# EAGLE design A3977_single_axis (EAGLE 7.6.0)
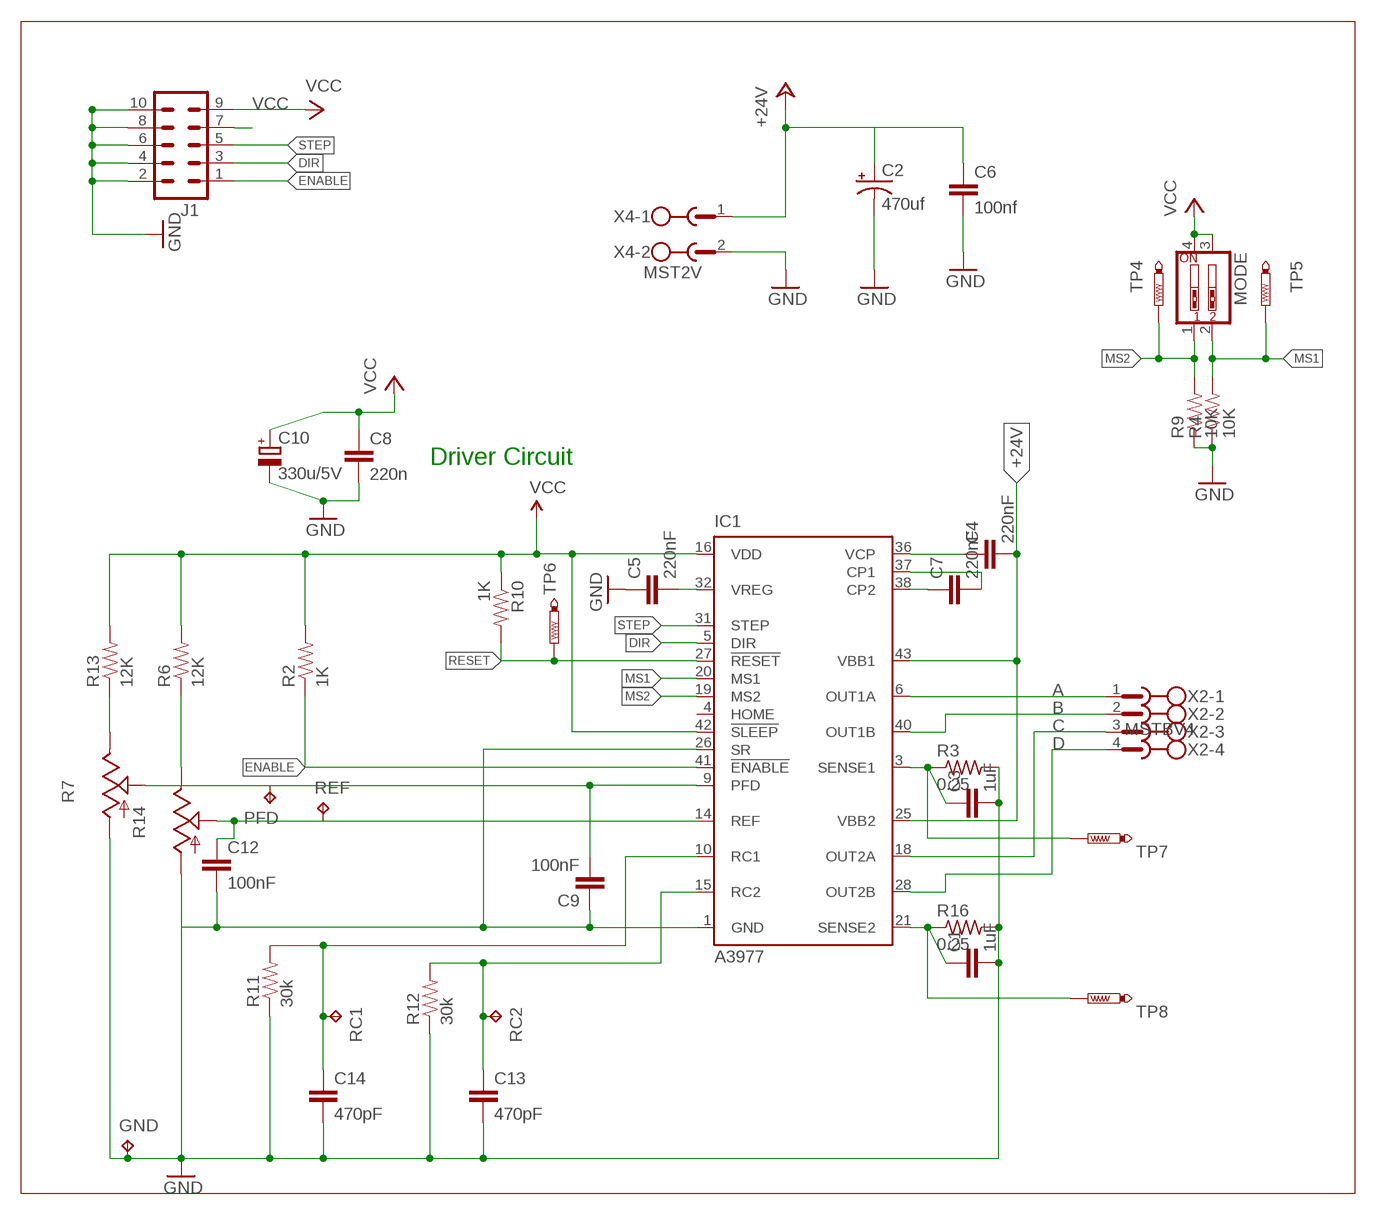
[diagram p0: schematic, sheet 1]

## Parts
C1  1uF  CAP0805  [0805]
C2  470uf  100UF-63V-20%(ELECT)  [NIC_10X10.5_CAP]
C3  1uF  CAP0805  [0805]
C4  220nF  CAP0805  [0805]
C5  220nF  CAP0805  [0805]
C6  100nf  C-EUC1206  [C1206]
C7  220nF  CAP0805  [0805]
C8  220n  C-EUC0805  [C0805]
C9  100nF  CAP0805  [0805]
C10  330u/5V  CPOL-EUF  [PANASONIC_F]
C12  100nF  CAP0805  [0805]
C13  470pF  CAP0805  [0805]
C14  470pF  CAP0805  [0805]
GND  TPPAD1-13  [P1-13]
IC1  A3977  [PLCC44]
J1  M05X2SHD  [2X5-SHROUDED]
MODE  SW_DIP-2  [EDG-02]
PFD  TPPAD1-13  [P1-13]
R2  1K  RESISTOR  [0805]
R3  0.25  R-US_R2512  [R2512]
R4  10K  RESISTOR  [0805]
R6  12K  RESISTOR  [0805]
R7  TRIM_US-CA6V  [CA6V]
R9  10K  RESISTOR  [0805]
R10  1K  RESISTOR  [0805]
R11  30k  RESISTOR  [0805]
R12  30k  RESISTOR  [0805]
R13  12K  RESISTOR  [0805]
R14  TRIM_US-CA6V  [CA6V]
R16  0.25  R-US_R2512  [R2512]
RC1  TPPAD1-13  [P1-13]
RC2  TPPAD1-13  [P1-13]
REF  TPPAD1-13  [P1-13]
TP4  PTR1TP09R  [TP09R]
TP5  PTR1TP09R  [TP09R]
TP6  PTR1TP09R  [TP09R]
TP7  PTR1TP09R  [TP09R]
TP8  PTR1TP09R  [TP09R]
X2  MSTBV4  [MSTBV4]
X4  MST2V  [MSTBV2]

## Nets
+24V: C2.+ C4.2 C6.1 IC1.25(VBB2) IC1.43(VBB1) X4.1
A [Power]: IC1.6(OUT1A) X2.1
B [Power]: IC1.40(OUT1B) X2.2
C [Power]: IC1.18(OUT2A) X2.3
D [Power]: IC1.28(OUT2B) X2.4
DIR: IC1.5(DIR) J1.3
ENABLE: IC1.41(!ENABLE) J1.1 R2.1
GND [Power]: C1.2 C2.- C3.2 C5.1 C6.2 C8.2 C9.1 C10.- C12.2 C13.2 C14.2 GND.TP IC1.1(GND) IC1.26(SR) J1.2 J1.4 J1.6 J1.8 J1.10 R3.2 R4.1 R7.A R9.1 R11.1 R12.1 R14.A R16.2 X4.2
MS1: IC1.20(MS1) MODE.2 R4.2 TP5.TP
MS2: IC1.19(MS2) MODE.1 R9.2 TP4.TP
N$1: C3.1 IC1.3(SENSE1) R3.1 TP7.TP
N$2: C1.1 IC1.21(SENSE2) R16.1 TP8.TP
N$3: C9.2 IC1.9(PFD) PFD.TP R7.S
N$4: C14.1 IC1.10(RC1) R11.2 RC1.TP
N$5: C13.1 IC1.15(RC2) R12.2 RC2.TP
N$6: R6.1 R14.E
N$7: C5.2 IC1.32(VREG)
N$8: R7.E R13.1
N$9: J1.7
N$11: C7.1 IC1.38(CP2)
N$13: C12.1 IC1.14(REF) R14.S REF.TP
N$15: C7.2 IC1.37(CP1)
N$16: C4.1 IC1.36(VCP)
RESET: IC1.27(!RESET) R10.2 TP6.TP
STEP: IC1.31(STEP) J1.5
VCC: C8.1 C10.+ IC1.16(VDD) IC1.42(!SLEEP) J1.9 MODE.3 MODE.4 R2.2 R6.2 R10.1 R13.2
Unconnected: IC1.4(HOME)

## Notes on the sheet
- Driver Circuit

## Power pins joined to a net without a drawn wire
GND: IC1.2(GND) IC1.11(GND) IC1.12(GND) IC1.13(GND) IC1.22(GND) IC1.23(GND) IC1.24(GND) IC1.33(GND) IC1.34(GND) IC1.35(GND) IC1.44(GND)

## Library data of the parts
C1 C3-C5 C7 C9 C12-C14 = SparkFun:CAP: Capacitor Standard 0603 ceramic capacitor, and 0.1" leaded capacitor.
C2 = SparkFun-Capacitors:100UF-63V-20%(ELECT): CAP-08362 100uF electrolytic SMT 63V 20%; PROD_ID: CAP-08362; VALUE: 100uF
C6 = resistor:C-EU: CAPACITOR, European symbol
C8 = rcl:C-EU: CAPACITOR, European symbol
C10 = rcl:CPOL-EU: POLARIZED CAPACITOR, European symbol
GND PFD RC1 RC2 REF = testpad:TP: Test pad
IC1 = linear:A3977: MICROSTEPPING DMOS DRIVER WITH TRANSLATOR Source: http://allegromicro.com/datafile/3977.pdf
J1 = SparkFun-Connectors:M05X2: Header 5x2 Standard 10-pin dual row 0.1" header. Commonly used with AVR-ISP. Use with Spark Fun Electronics SKU: PRT-00778
MODE = special:SW_DIP-2: DIP SWITCH
R2 R4 R6 R9-R13 = SparkFun:RESISTOR: Resistor Basic schematic elements and footprints for 0603, 1206, and PTH 1/10th watt (small) resistors.
R3 R16 = rcl:R-US_: RESISTOR, American symbol
R7 R14 = pot:TRIM_US-: POTENTIOMETER
TP4-TP8 = testpad:PTR1: TEST PIN
X2 = con-phoenix-508:MSTBV4: PHOENIX; MPN: MSTBV 2,5/4-GF-5.08; OC_FARNELL: 1792794; OC_NEWARK: 69R9847
X4 = con-phoenix-508:MST2V: PHOENIX; OC_FARNELL: unknown; OC_NEWARK: unknown

## Net classes
0 default: width 0.381 mm
1 Power: width 0.635 mm, drill 0.381 mm, clearance 0.508 mm
2 Trunk: width 1.676 mm, clearance 0.508 mm

## Board
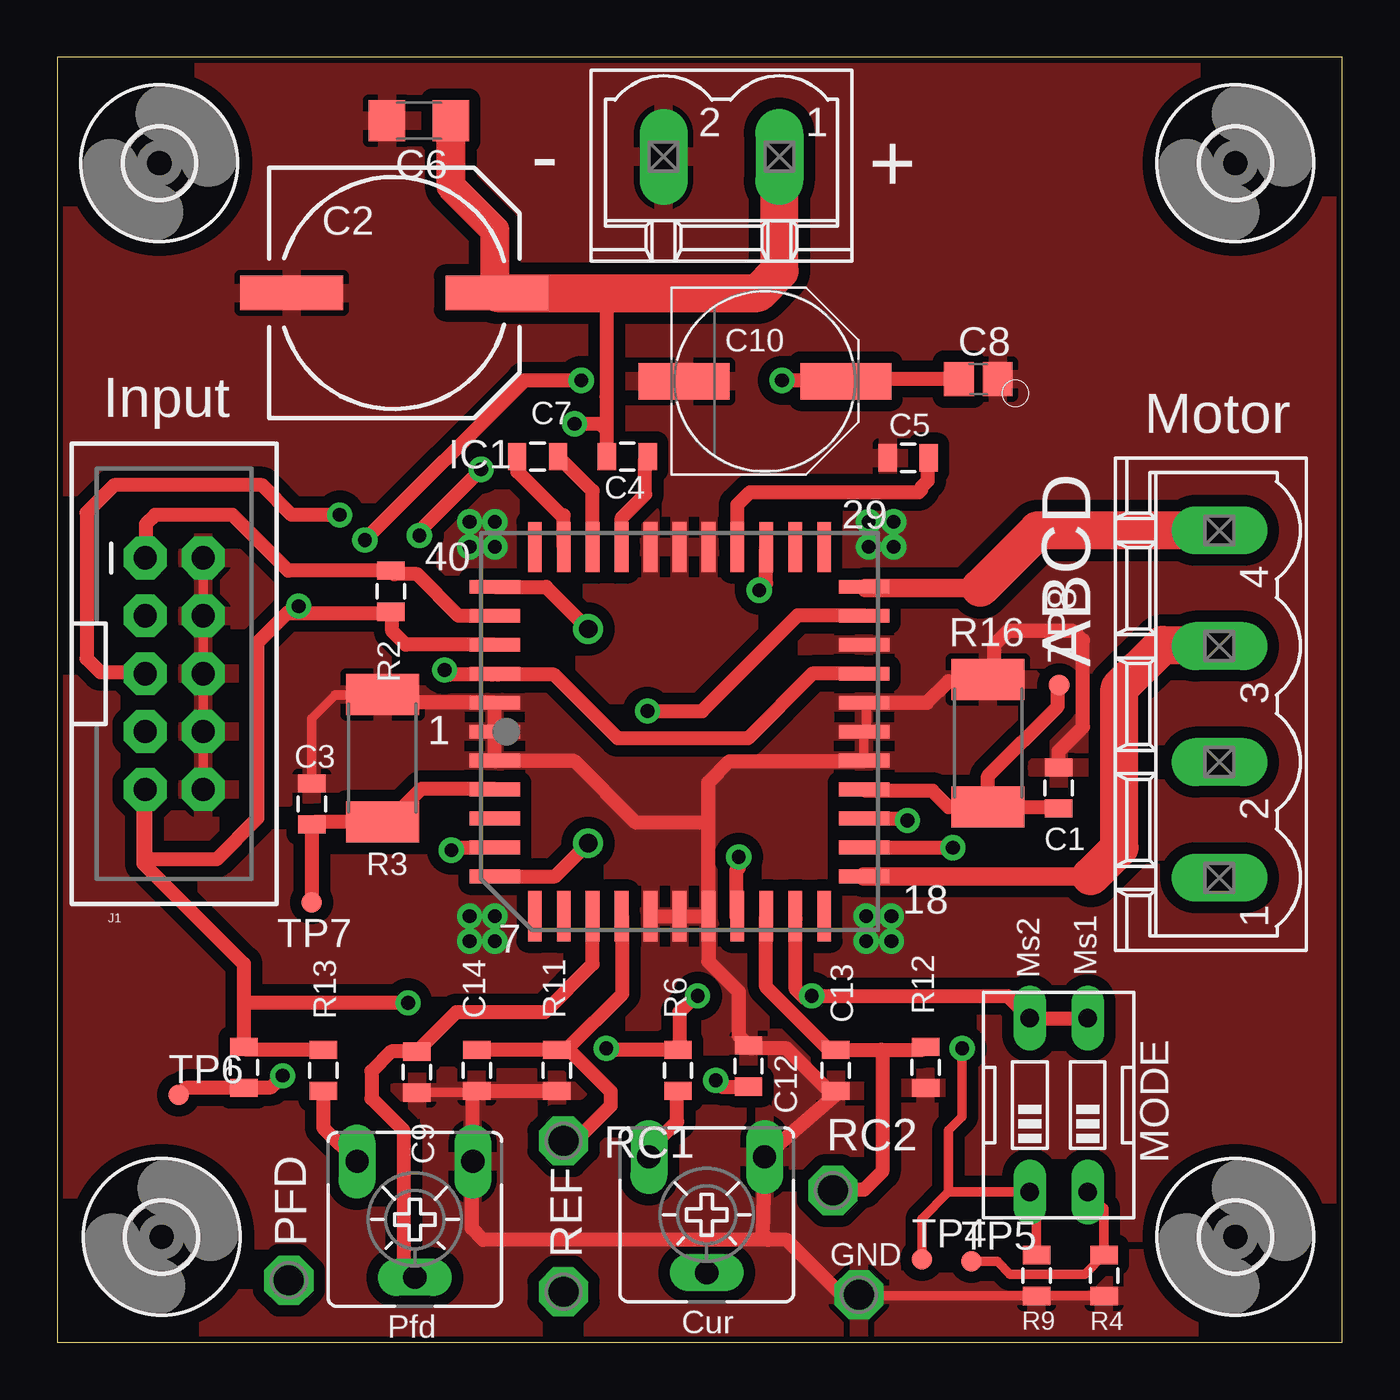
[diagram p1: board, top side]
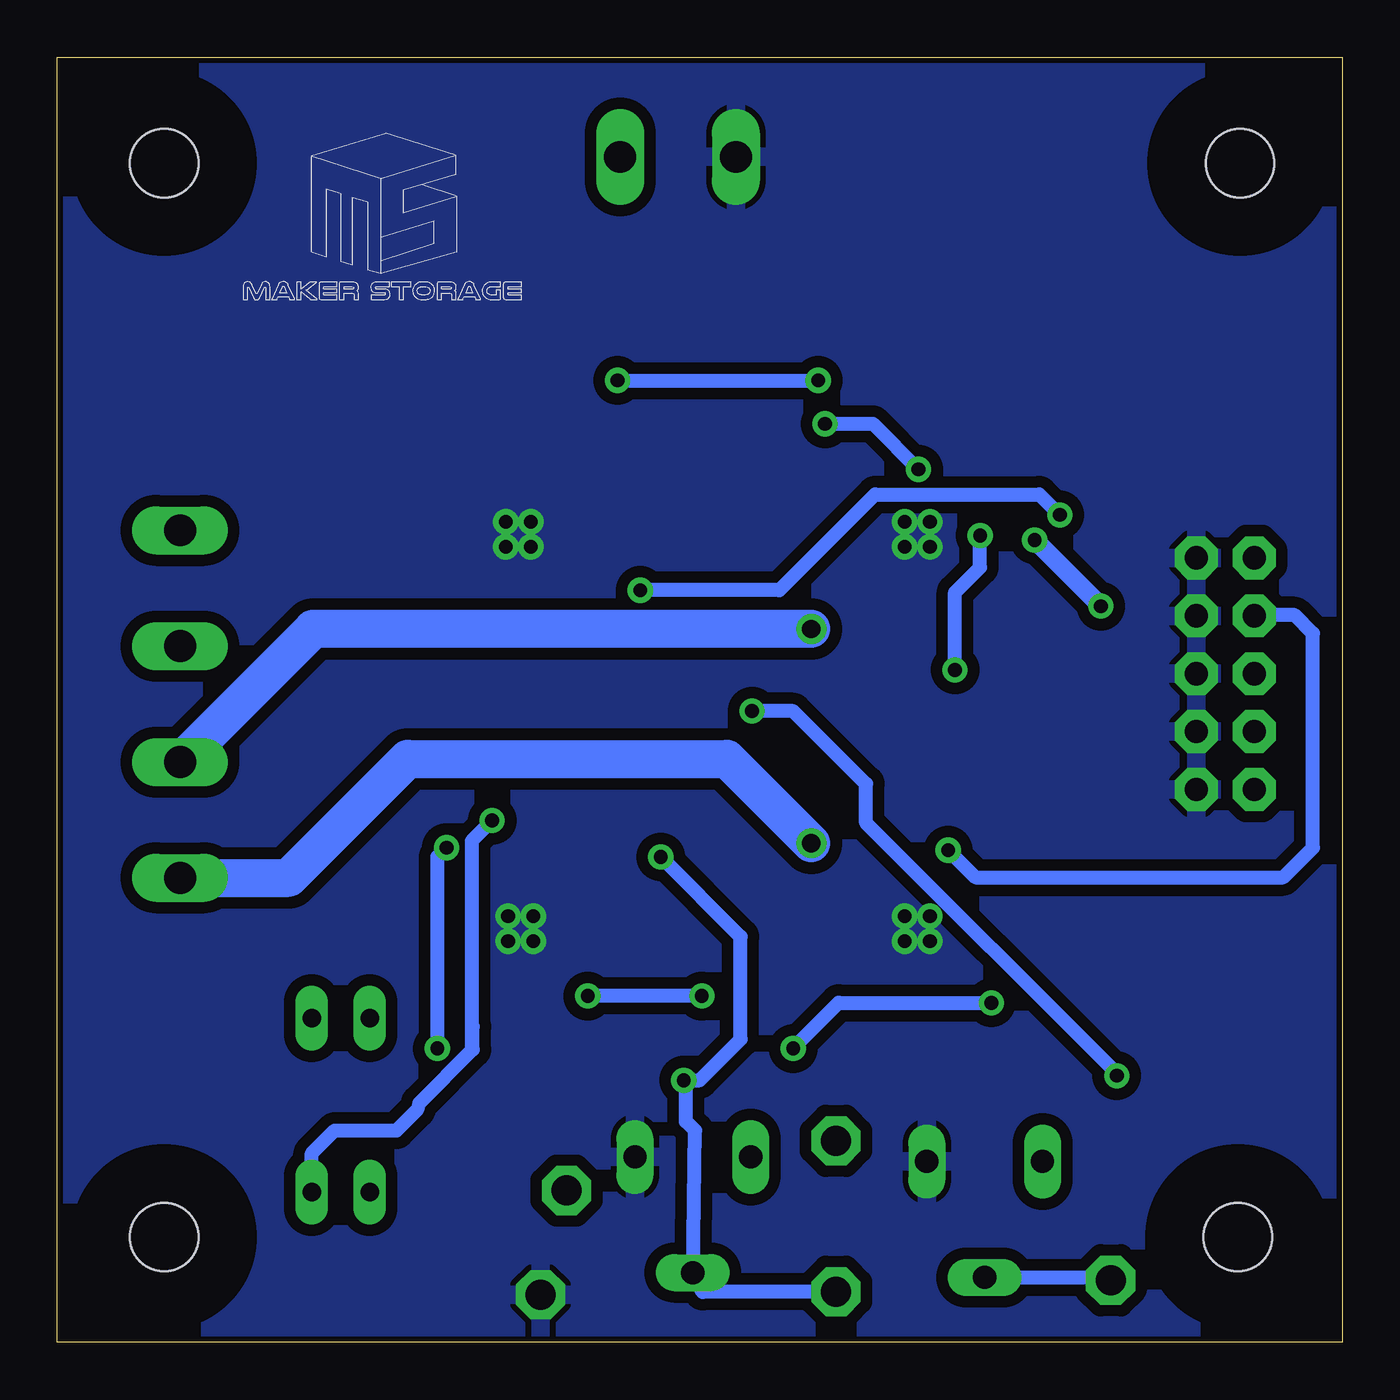
[diagram p2: board, bottom side, seen from below]

Size 56.39 x 56.39 mm. Coordinates in mm from the lower left corner, seen from the top.
Outline: 0,0 56.39,0 56.39,56.39 0,56.39 0,0
Copper layers (1*16): Top 0.035mm / dielectric 1.5mm / Bottom 0.035mm
Design rules "SparkFun": minimum track width 8mil, minimum drill 20mil, track to track 8mil, track to pad 8mil, pad to pad 8mil, via to via 8mil, smd to smd 8mil, copper to edge 10mil, drill to drill 8mil, minimum pad ring 12mil, minimum via ring 10mil, stop-mask expansion 4mil, vias tented up to drill 25mil, thermal gap 10mil

### Footprints (pad centres in the part's own frame; a part is rotated, then mirrored left to right if it is on the bottom)
0805 = smd 0.8 x 1.2: 1 -0.9,0; 2 0.9,0
NIC_10X10.5_CAP = smd 4.5 x 1.5: + 4.5,0; - -4.5,0
C1206 = smd 1.6 x 1.8: 1 -1.4,0; 2 1.4,0
C0805 = smd 1.3 x 1.5: 1 -0.85,0; 2 0.85,0
PANASONIC_F = smd 4 x 1.6: + 3.55,0; - -3.55,0
P1-13 = drill 1.321 pad 2.159 octagon: TP 0,0
PLCC44 = smd 0.6 x 2.2: 1 0,8.1; 2 -1.27,8.1; 3 -2.54,8.1; 4 -3.81,8.1; 5 -5.08,8.1; 6 -6.35,8.1; 18 -6.35,-8.1; 19 -5.08,-8.1; 20 -3.81,-8.1; 21 -2.54,-8.1; 22 -1.27,-8.1; 23 0,-8.1; 24 1.27,-8.1; 25 2.54,-8.1; 26 3.81,-8.1; 27 5.08,-8.1; 28 6.35,-8.1; 40 6.35,8.1; 41 5.08,8.1; 42 3.81,8.1; 43 2.54,8.1; 44 1.27,8.1 | smd 2.2 x 0.6: 7 -8.1,6.35; 8 -8.1,5.08; 9 -8.1,3.81; 10 -8.1,2.54; 11 -8.1,1.27; 12 -8.1,0; 13 -8.1,-1.27; 14 -8.1,-2.54; 15 -8.1,-3.81; 16 -8.1,-5.08; 17 -8.1,-6.35; 29 8.1,-6.35; 30 8.1,-5.08; 31 8.1,-3.81; 32 8.1,-2.54; 33 8.1,-1.27; 34 8.1,0; 35 8.1,1.27; 36 8.1,2.54; 37 8.1,3.81; 38 8.1,5.08; 39 8.1,6.35
2X5-SHROUDED = drill 1.016 pad 1.88 octagon: 1 -1.27,5.08; 2 1.27,5.08; 3 -1.27,2.54; 4 1.27,2.54; 5 -1.27,0; 6 1.27,0; 7 -1.27,-2.54; 8 1.27,-2.54; 9 -1.27,-5.08; 10 1.27,-5.08
EDG-02 = drill 0.813 long: 1 -1.27,-3.81; 2 1.27,-3.81; 3 1.27,3.81; 4 -1.27,3.81
R2512 = smd 1.8 x 3.2: 1 -2.8,0; 2 2.8,0
CA6V = drill 1.016 long: A -2.54,-2.54; E 2.54,-2.54; S 0,2.54
TP09R = smd 0.9 x 0.9: TP 0,0
3,0 = hole 3: 0,0
MSTBV4 = drill 1.397 long: 1 -7.62,0; 2 -2.54,0; 3 2.54,0; 4 7.62,0
MSTBV2 = drill 1.397 long: 1 -2.54,0; 2 2.54,0

### Placement (x,y rotation side)
C1  43.94,24.32 90 top
C2  14.8,46.04 0 top
C3  11.18,23.62 90 top
C4  25.02,38.86 180 top
C5  37.34,38.8 0 top
C6  15.88,53.59 180 top
C7  21.08,38.86 0 top
C8  40.41,42.26 0 top
C9  15.79,11.86 90 top
C10  31.05,42.16 0 top
C12  30.33,12.13 90 top
C13  34.16,11.94 270 top
C14  18.41,11.94 270 top
GND  35.18,2.1 0 top
IC1  27.3,26.8 90 top
J1  5.14,29.34 0 top
MODE  43.94,10.41 0 top
PFD  10.17,2.72 0 top
R2  14.64,32.96 270 top
R3  14.27,25.63 90 top
R4  45.93,2.94 90 top
R6  27.24,11.94 90 top
R7  15.7,5.4 180 top
R9  42.97,2.94 90 top
R10  8.19,12.06 270 top
R11  21.93,11.94 90 top
R12  38.1,12.06 90 top
R13  11.68,11.94 90 top
R14  28.5,5.6 180 top
R16  40.84,26.29 90 top
RC1  22.21,8.85 0 top
RC2  34.04,6.67 0 top
REF  22.22,2.22 0 top
TP4  37.93,3.66 0 top
TP5  40.11,3.56 0 top
TP6  5.33,10.86 0 top
TP7  11.18,19.3 0 top
TP8  43.96,28.83 0 top
U$1  [3,0]  4.49,51.73 0 top
U$2  [3,0]  51.69,51.73 0 top
U$3  [3,0]  4.59,4.63 0 top
U$4  [3,0]  51.69,4.63 0 top
X2  50.99,28 90 top
X4  29.15,52.01 180 top

### Tracks (layer width: path | path; a pad name or v marks a point on that pad's centre or on a via)
+24V  (via drill 0.6)
  Top 0.406: 19.1,29.3 19.2,29.4 IC1.43 | 24,41.5 24.12,41.7
  Top 0.61: C4.2 24.12,40 | 24.12,40 24.12,41.7 24.12,45.58 23.6,46.1 19.36,46.1 C2.+ 19.2,46.13 | 31.7,51.99 X4.1 | IC1.25 33.14,29.34 30.3,26.5 24.6,26.5 21.8,29.3 19.34,29.3 IC1.43 | 19.1,29.3 17.2,29.3 v17,29.5 | v22.7,40.3 23.82,40.3 24.12,40 | v15.9,35.4 15.9,35.6 v18.6,38.3
  Top 1.27: C6.1 17.27,50.73 19.2,48.8 19.2,46.13
  Top 1.676: C2.+ 30.74,46.04 31.7,47 31.7,51.99
  Bottom 0.61: v22.7,40.3 20.6,40.3 v18.6,38.3 | v17,29.5 17,32.9 15.9,34 v15.9,35.4
A  (via drill 0.8)
  Top 0.61: IC1.6 21.85,20.45 v23.3,21.9
  Bottom 1.676: X2.1 46.22,20.38 41,25.6 27,25.6 v23.3,21.9
B  (via drill 0.8)
  Top 0.61: IC1.40 21.45,33.15 v23.3,31.3
  Bottom 1.676: v23.3,31.3 45.15,31.3 X2.2
C
  Top 0.61: 50.93,30.6 X2.3
  Top 0.813: IC1.18 45.35,20.45
  Top 1.676: 45.35,20.45 46.6,21.7 46.6,28.7 48.5,30.6 50.93,30.6
D
  Top 0.61: 35.45,33.1 IC1.28
  Top 0.813: 40.5,33.1 35.45,33.1
  Top 1.676: X2.4 43.02,35.62 40.5,33.1
DIR  (via drill 0.6)
  Top 0.406: 17.4,21.7 v17.3,21.6 | 19.1,21.7 19.2,21.8 IC1.5
  Top 0.61: 19.1,21.7 17.4,21.7
  Bottom 0.406: 3.8,31.8 J1.3 | v17.3,21.6 17.3,21.5
  Bottom 0.61: 17.3,21.5 17.2,21.5 16.1,20.4 2.6,20.4 1.3,21.7 1.3,31.1 2.1,31.9 3.85,31.9 J1.3
ENABLE
  Top 0.61: IC1.41 17.62,31.88 15.8,33.7 14.8,33.7 R2.1 10.14,33.86 7.7,36.3 4.3,36.3 3.9,35.9 3.9,34.44 J1.1
GND  (via drill 0.6)
  Top 0.406: R4.1 R9.1 35.23,2.04 GND.TP | C9.1 18.34,10.96 C14.2 | 35.38,25.5 IC1.22 IC1.23 35.41,26.89 | 35.41,26.89 35.4,26.9 | 35.41,26.89 35.5,26.8 35.5,27.97 IC1.24 | 14.64,28.07 R3.2 14.25,28.4 12.2,28.4 11.18,27.38 C3.2 | J1.10 J1.8 J1.6 J1.4 J1.2
  Top 0.61: IC1.11 IC1.12 IC1.13 | IC1.13 28.57,22.8 | 28.57,22.8 28.57,24.57 29.5,25.5 35.38,25.5 | 14.64,28.07 IC1.44 IC1.1 IC1.2 19.23,25.5 22.7,25.5 25.4,22.8 28.57,22.8 | R11.1 C14.2 18.24,10.86 R7.A 18.2,7.9 18.2,5 18.7,4.5 31.2,4.5 | IC1.13 28.57,16.73 29.9,15.4 29.9,13.46 C12.2 30.46,12.9 32,12.9 33.86,11.04 C13.2 34.16,10.86 R14.A 30.94,4.76 31.2,4.5 | GND.TP 34.4,2.1 32,4.5 31.2,4.5 | IC1.24 38.17,28.07 39.1,29 40.75,29 R16.2 41.1,29.35 41.1,30.6 41.7,31.2 44.6,31.2 45,30.8 45,27 43.94,25.94 C1.2
  other vias: 35.5,18.7 36.6,18.7 35.5,17.6 36.6,17.6 35.6,36 36.7,36 35.6,34.9 36.7,34.9 18.1,18.7 19.2,18.7 18.1,17.6 19.2,17.6 18.1,36 19.2,36 18.1,34.9 19.2,34.9
  pour Top: -1.27,57.91 59.69,57.91 59.69,-0.51 -1.27,-0.51
  pour Bottom: -1.27,57.91 59.69,57.91 59.69,-0.51 -1.27,-0.51
MS1  (via drill 0.6)
  Top 0.406: MODE.2 45.93,5.89 R4.2 45.09,3 41.8,3 41.24,3.56 TP5.TP
  Top 0.61: IC1.20 37.21,22.99 v37.3,22.9
  Bottom 0.61: MODE.2 45.21,8.29 44.2,9.3 41.5,9.3 40.6,10.2 40.5,10.5 38.15,12.85 | v37.3,22.9 38.2,22 38.2,13.9 | 38.2,13.9 38.2,12.9 38.15,12.85 | 38.15,12.85 38.15,13.85 38.2,13.9
MS2  (via drill 0.6)
  Top 0.406: R9.2 42.97,6.31 MODE.1 39.1,6.6 | TP4.TP 37.93,5.43 39.1,6.6 | 39.1,6.6 39.1,9.3 39.7,9.9 v39.7,12.9 | 35.5,21.7 IC1.19
  Top 0.61: v39.3,21.7 35.42,21.7 IC1.19
  Bottom 0.61: v39.7,12.9 39.7,21.3 v39.3,21.7
N$1
  Top 0.61: TP7.TP C3.1 11.28,22.83 R3.1 14.53,22.83 16,24.3 19.16,24.3 IC1.3
N$2
  Top 0.61: R16.1 39.11,23.49 38.4,24.2 35.46,24.2 IC1.21 | R16.1 43.87,23.49 C1.1 | R16.1 40.84,24.84 43.9,27.9 43.9,28.77 TP8.TP
N$3
  Top 0.61: R7.S 15.2,3.36 15.2,9.3 13.8,10.7 13.8,11.9 14.66,12.76 C9.2 17.52,14.5 21.4,14.5 23.5,16.6 IC1.9
  Bottom 0.61: R7.S 10.17,2.86 PFD.TP
N$4
  Top 0.61: R11.2 22.34,12.84 22.4,12.9 | 22.4,12.9 24.8,15.3 24.8,18.66 IC1.10 | R11.2 C14.1 | RC1.TP 22.75,8.85 24.3,10.4 24.3,11 22.4,12.9 | 22.4,12.9 21.99,12.9 R11.2
N$5
  Top 0.61: C13.1 37.97,12.84 R12.2 | C13.1 36.16,12.84 36.2,12.8 36.2,7.5 35.4,6.7 34.07,6.7 RC2.TP | C13.1 33.86,12.84 31.1,15.6 31.1,18.68 IC1.15
N$6
  Top 0.61: R14.E 25.86,8.36 27.2,9.7 27.2,11 R6.1
N$7
  Top 0.61: IC1.32 29.84,36.74 30.4,37.3 37.8,37.3 37.9,37.4 37.9,37.5 38.2,37.8 38.2,38.76 C5.2
N$8
  Top 0.61: R13.1 11.68,9.42 R7.E
N$11
  Top 0.61: IC1.38 22.23,36.27 22.12,36.27 20.2,38.2 20.2,38.84 C7.1
N$13  (via drill 0.6)
  Top 0.381: 29.8,20.59 29.79,20.59 29.9,20.8
  Top 0.61: v28.9,11.5 29.2,11.2 29.9,11.2 C12.1 | IC1.14 29.8,18.7 29.8,20.59 29.8,20.7 | 29.9,20.8 v29.9,21.3
  Bottom 0.61: REF.TP 28.06,2.22 R14.S 28.4,9.3 28.8,9.7 28.8,11.4 v28.9,11.5 28.2,11.5 26.4,13.3 26.4,17.8 v29.9,21.3
N$15
  Top 0.61: IC1.37 23.5,37.35 C7.2
N$16
  Top 0.61: IC1.36 24.77,36.16 25.8,37.2 25.8,38.74 C4.1
RESET  (via drill 0.6)
  Top 0.406: 35.4,31.9 IC1.27 | 8.5,11.2 8.4,11.1 R10.2
  Top 0.61: R10.2 5.64,11.16 TP6.TP | v9.9,11.7 9.4,11.2 8.5,11.2 | v25.9,27.7 28.3,27.7 32.5,31.9 35.38,31.9 IC1.27
  Bottom 0.61: v9.9,11.7 9.9,11.8 20.9,22.8 20.9,24.5 24.1,27.7 v25.9,27.7
STEP  (via drill 0.6)
  Top 0.61: v30.8,33 31.1,33.3 31.1,34.8 IC1.31 | J1.5 3.8,29.4 1.9,29.4 1.3,30 1.3,36.4 2.5,37.6 9,37.6 10.3,36.3 v12.4,36.3
  Bottom 0.61: v30.8,33 24.7,33 20.5,37.2 13.3,37.2 v12.4,36.3
VCC  (via drill 0.6)
  Top 0.406: v10.6,32.3 10.6,32 | 34.3,42.2 C10.+
  Top 0.61: 27.3,12.8 R6.2 | IC1.16 32.4,18.6 32.4,15.5 32.8,15.1 v33.1,15.2 41.7,15.2 MODE.4 MODE.3 | C8.1 34.7,42.26 C10.+ | IC1.42 15.29,30.61 14.7,31.2 14.7,32 R2.2 14.59,32 10.6,32 10.1,32 8.8,30.7 8.8,23 7,21.2 4.2,21.2 3.9,20.9 | 3.9,21.2 3.87,21.23 J1.9 3.8,24.18 3.8,21 3.9,20.9 | R6.2 24.44,12.84 24.4,12.8 v24.1,12.9 | R13.2 8.32,12.84 R10.1 8.19,14.8 | 34.3,42.2 v31.8,42.2 | v15.4,14.9 8.29,14.9 8.19,14.8 | 8.19,14.8 8.19,16.61 3.9,20.9 | v28.1,15.2 28,15.2 27.3,14.5 27.3,12.9 R6.2 | v23,42.2 20.5,42.2 v13.5,35.2
  Bottom 0.61: v28.1,15.2 v33.1,15.2 | v15.4,14.9 22.1,14.9 v24.1,12.9 | v31.8,42.2 v23,42.2
  Bottom 0.813: v10.6,32.3 v13.5,35.2

### Text on the board
tPlace: - | + | Input | Motor | ABCD | Ms2 | Ms1 | Pfd | Cur
_tsilk: 29 | 40 | 1 | 18 | 7